# Altium schematic sheet RS485.SchDoc
size A4
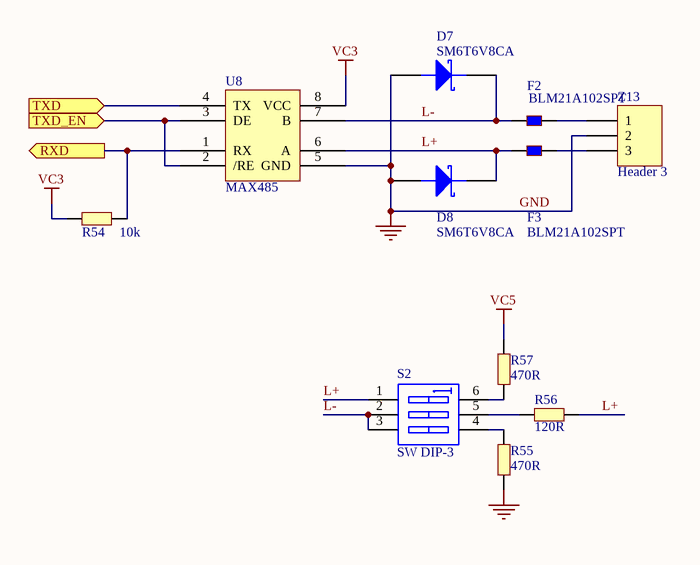
[diagram p0: RS485.SchDoc]

## Parts
D7  SM6T6V8CA  [RD5_U]
D8  SM6T6V8CA  [RD5_U]
F2  BLM21A102SPT  [0805]
F3  BLM21A102SPT  [0805]
R54  10k  [0805R]
R55  470R  [1206]
R56  120R  [1206]
R57  470R  [1206]
S2  SW DIP-3  [DIP-6]
U8  MAX485  [SO8]
Z13  Header 3  [ARC-L-3-3.5]

## Ports
RXD (out), TXD (in), TXD_EN (in)

## Nets
GND: D7.A D8.A R55.2 U8.5(GND) Z13.2
VC3: R54.1 U8.8(VCC)
VC5: R57.2
L+: D8.K F3.1 R56.2 S2.1(A1) U8.6(A)
L-: D7.K F2.1 S2.2(A2) S2.3(A3) U8.7(B)
RXD: R54.2 U8.1(RX) ; port RXD
TXD: U8.4(TX) ; port TXD
TXD_EN: U8.2(/RE) U8.3(DE) ; port TXD_EN
NetF2_2: F2.2 Z13.1
NetF3_2: F3.2 Z13.3
NetR55_1: R55.1 S2.4(B3)
NetR56_1: R56.1 S2.5(B2)
NetR57_1: R57.1 S2.6(B1)

## Library data of the parts
D7 D8 = DIODE SCHOTTKY: Schottky Diode
F2 F3 = KORALIK: Koralik ferrytowy
R54-R57 = RES3
S2 = SW DIP-3: DIP Switch, 3 Position, SPST; Published: 24-Mar-1999; LatestRevisionDate: 17-Jul-2002; LatestRevisionNote: Re-released for DXP Platform.; PackageReference: DIP-6; Publisher: Altium Limited; Code_JEDEC: MO-001-AM
U8 = MAX485_1
Z13 = Header 3: Header, 3-Pin; LatestRevisionDate: 17-Jul-2002; LatestRevisionNote: Re-released for DXP Platform.; Publisher: Altium Limited